# EAGLE design MCPTQFP100 (EAGLE 5.11)
PROJECT: Microchip TQFP-100 BB V1
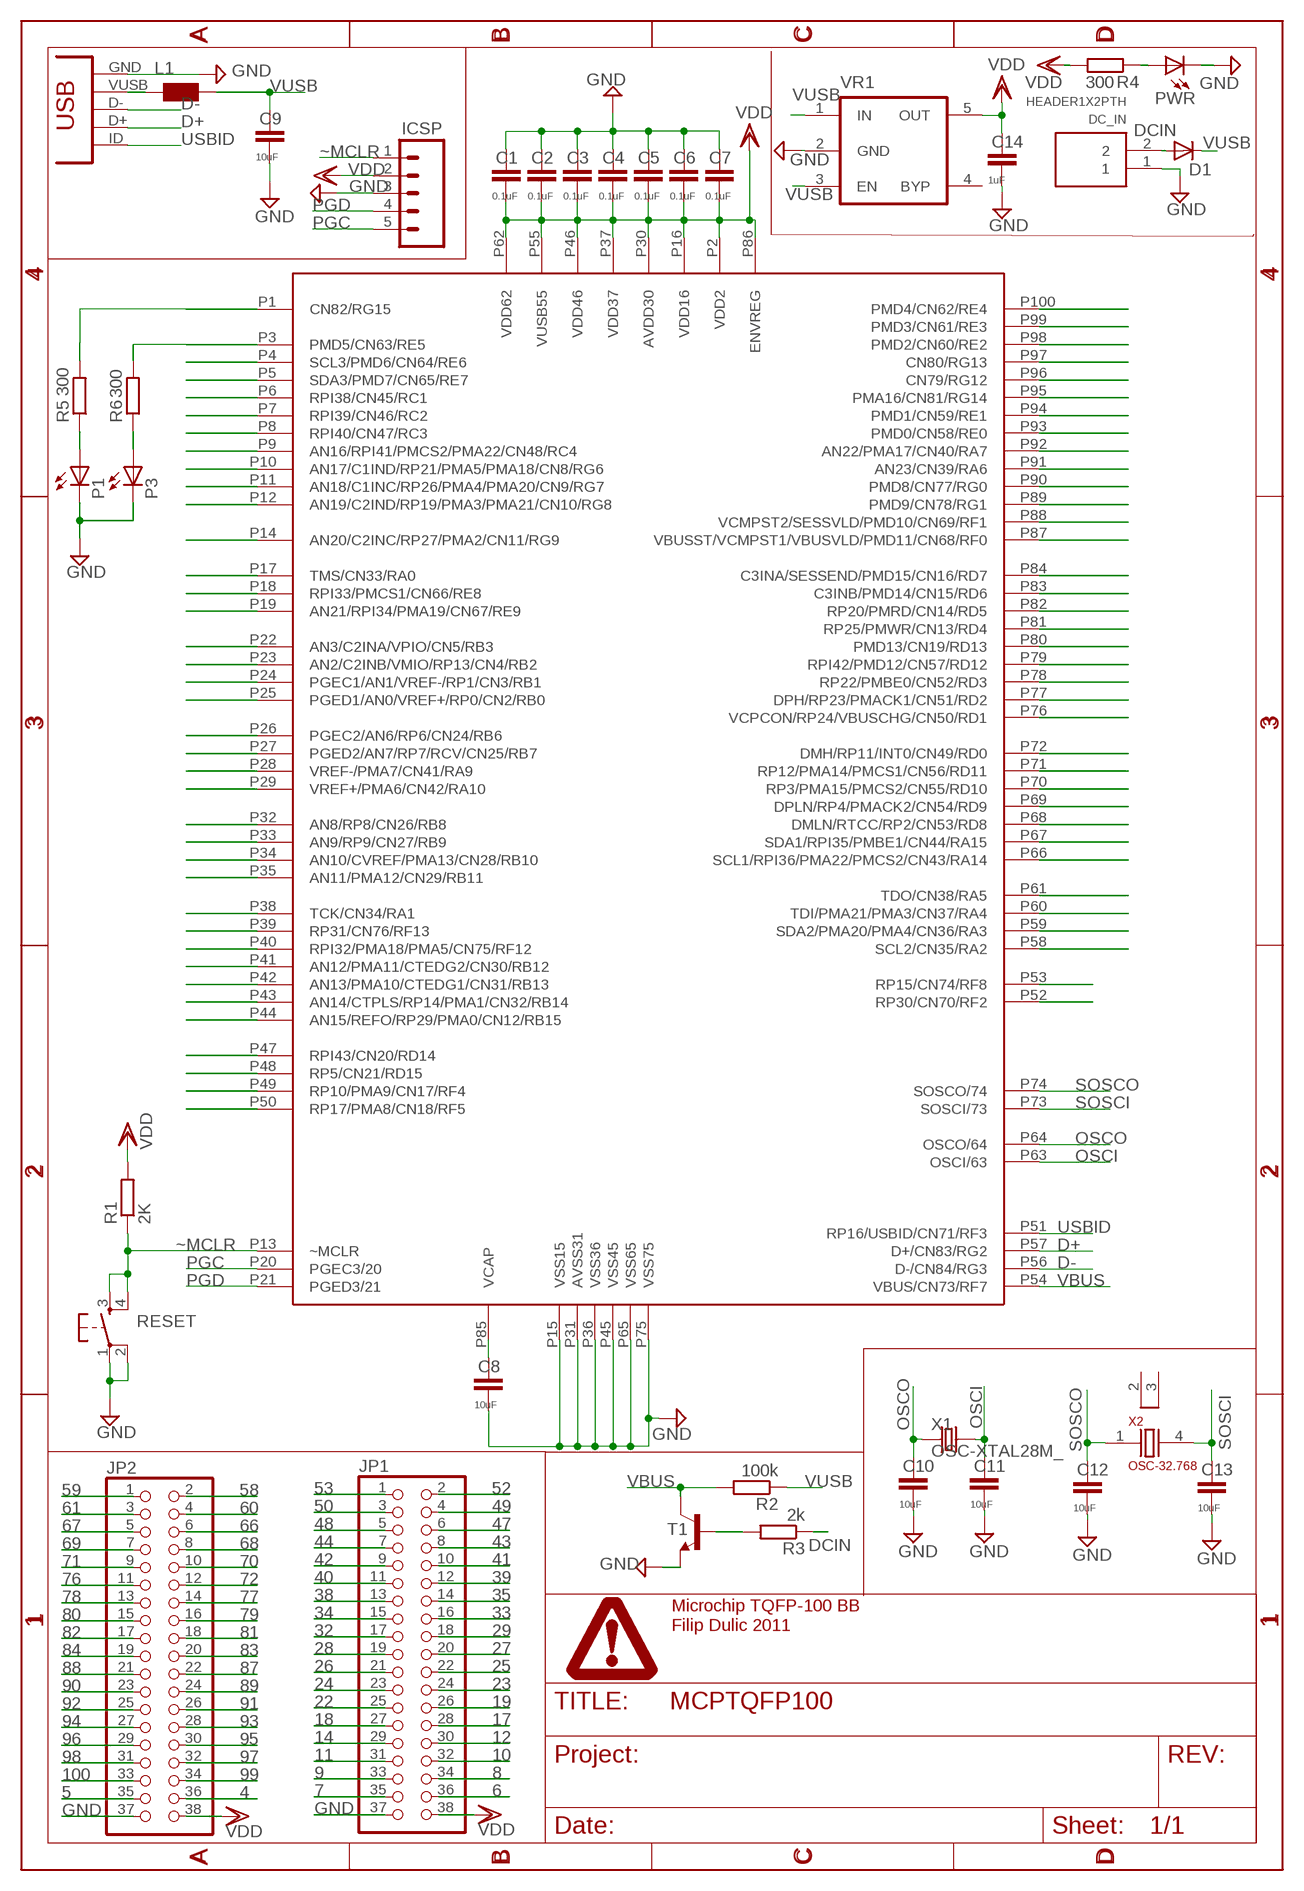
[diagram p0: schematic, sheet 1]

## Parts
C1  0.1uF  CAPC603  [C603]
C2  0.1uF  CAPC603  [C603]
C3  0.1uF  CAPC603  [C603]
C4  0.1uF  CAPC603  [C603]
C5  0.1uF  CAPC603  [C603]
C6  0.1uF  CAPC603  [C603]
C7  0.1uF  CAPC603  [C603]
C8  10uF  CAPC805  [C805]
C9  10uF  CAPC603  [C603]
C10  10uF  CAPC603  [C603]
C11  10uF  CAPC603  [C603]
C12  10uF  CAPC603  [C603]
C13  10uF  CAPC603  [C603]
C14  1uF  CAPC805  [C805]
D1  DIODE-SOD123  [SOD123]
DC_IN  HEADER1X2PTH  [M1X2]
IC1  PIC24FJ256GB210  [DP_DEVICES_TQFP100-12MMX12MM]
ICSP  M05PTH  [1X05]
JP1  PINHD-2X19  [2X19]
JP2  PINHD-2X19  [2X19]
L1  WE-KIL_0805  [WE-KI_0805_B]
P1  P4  LEDCHIP-LED0805  [CHIP-LED0805]
P3  P4  LEDCHIP-LED0805  [CHIP-LED0805]
PWR  P4  LEDCHIP-LED0805  [CHIP-LED0805]
R1  2K  RESISTORR805R805  [R805]
R2  100k  RESISTORR805R805  [R805]
R3  2k  RESISTORR805R805  [R805]
R4  300  RESISTORR805R805  [R805]
R5  300  RESISTORR805R805  [R805]
R6  300  RESISTORR805R805  [R805]
RESET  SW-SMD-SMALL  [TACT_SWITCH_SMALL]
T1  BJT-NPNSOT23EBC  [SOT23-EBC]
U$1  DINA4_L  [DP_LOGO]
USB  CON-USB-MINI-BUSB1  [CONN_USB_MINI-B]
VR1  MIC5205  [SOT-23-5]
X1  OSC-XTAL28M_  [5X8]
X2  OSC-32.768  [CM309S]

## Nets
1: IC1.P1(CN82/RG15) R5.2
3: IC1.P3(PMD5/CN63/RE5) R6.2
4: IC1.P4(SCL3/PMD6/CN64/RE6) JP2.36
5: IC1.P5(SDA3/PMD7/CN65/RE7) JP2.35
6: IC1.P6(RPI38/CN45/RC1) JP1.36
7: IC1.P7(RPI39/CN46/RC2) JP1.35
8: IC1.P8(RPI40/CN47/RC3) JP1.34
9: IC1.P9(AN16/RPI41/PMCS2/PMA22/CN48/RC4) JP1.33
10: IC1.P10(AN17/C1IND/RP21/PMA5/PMA18/CN8/RG6) JP1.32
11: IC1.P11(AN18/C1INC/RP26/PMA4/PMA20/CN9/RG7) JP1.31
12: IC1.P12(AN19/C2IND/RP19/PMA3/PMA21/CN10/RG8) JP1.30
14: IC1.P14(AN20/C2INC/RP27/PMA2/CN11/RG9) JP1.29
17: IC1.P17(TMS/CN33/RA0) JP1.28
18: IC1.P18(RPI33/PMCS1/CN66/RE8) JP1.27
19: IC1.P19(AN21/RPI34/PMA19/CN67/RE9) JP1.26
22: IC1.P22(AN3/C2INA/VPIO/CN5/RB3) JP1.25
23: IC1.P23(AN2/C2INB/VMIO/RP13/CN4/RB2) JP1.24
24: IC1.P24(PGEC1/AN1/VREF-/RP1/CN3/RB1) JP1.23
25: IC1.P25(PGED1/AN0/VREF+/RP0/CN2/RB0) JP1.22
26: IC1.P26(PGEC2/AN6/RP6/CN24/RB6) JP1.21
27: IC1.P27(PGED2/AN7/RP7/RCV/CN25/RB7) JP1.20
28: IC1.P28(VREF-/PMA7/CN41/RA9) JP1.19
29: IC1.P29(VREF+/PMA6/CN42/RA10) JP1.18
32: IC1.P32(AN8/RP8/CN26/RB8) JP1.17
33: IC1.P33(AN9/RP9/CN27/RB9) JP1.16
34: IC1.P34(AN10/CVREF/PMA13/CN28/RB10) JP1.15
35: IC1.P35(AN11/PMA12/CN29/RB11) JP1.14
38: IC1.P38(TCK/CN34/RA1) JP1.13
39: IC1.P39(RP31/CN76/RF13) JP1.12
40: IC1.P40(RPI32/PMA18/PMA5/CN75/RF12) JP1.11
41: IC1.P41(AN12/PMA11/CTEDG2/CN30/RB12) JP1.10
42: IC1.P42(AN13/PMA10/CTEDG1/CN31/RB13) JP1.9
43: IC1.P43(AN14/CTPLS/RP14/PMA1/CN32/RB14) JP1.8
44: IC1.P44(AN15/REFO/RP29/PMA0/CN12/RB15) JP1.7
47: IC1.P47(RPI43/CN20/RD14) JP1.6
48: IC1.P48(RP5/CN21/RD15) JP1.5
49: IC1.P49(RP10/PMA9/CN17/RF4) JP1.4
50: IC1.P50(RP17/PMA8/CN18/RF5) JP1.3
52: IC1.P52(RP30/CN70/RF2) JP1.2
53: IC1.P53(RP15/CN74/RF8) JP1.1
58: IC1.P58(SCL2/CN35/RA2) JP2.2
59: IC1.P59(SDA2/PMA20/PMA4/CN36/RA3) JP2.1
60: IC1.P60(TDI/PMA21/PMA3/CN37/RA4) JP2.4
61: IC1.P61(TDO/CN38/RA5) JP2.3
66: IC1.P66(SCL1/RPI36/PMA22/PMCS2/CN43/RA14) JP2.6
67: IC1.P67(SDA1/RPI35/PMBE1/CN44/RA15) JP2.5
68: IC1.P68(DMLN/RTCC/RP2/CN53/RD8) JP2.8
69: IC1.P69(DPLN/RP4/PMACK2/CN54/RD9) JP2.7
70: IC1.P70(RP3/PMA15/PMCS2/CN55/RD10) JP2.10
71: IC1.P71(RP12/PMA14/PMCS1/CN56/RD11) JP2.9
72: IC1.P72(DMH/RP11/INT0/CN49/RD0) JP2.12
76: IC1.P76(VCPCON/RP24/VBUSCHG/CN50/RD1) JP2.11
77: IC1.P77(DPH/RP23/PMACK1/CN51/RD2) JP2.14
78: IC1.P78(RP22/PMBE0/CN52/RD3) JP2.13
79: IC1.P79(RPI42/PMD12/CN57/RD12) JP2.16
80: IC1.P80(PMD13/CN19/RD13) JP2.15
81: IC1.P81(RP25/PMWR/CN13/RD4) JP2.18
82: IC1.P82(RP20/PMRD/CN14/RD5) JP2.17
83: IC1.P83(C3INB/PMD14/CN15/RD6) JP2.20
84: IC1.P84(C3INA/SESSEND/PMD15/CN16/RD7) JP2.19
87: IC1.P87(VBUSST/VCMPST1/VBUSVLD/PMD11/CN68/RF0) JP2.22
88: IC1.P88(VCMPST2/SESSVLD/PMD10/CN69/RF1) JP2.21
89: IC1.P89(PMD9/CN78/RG1) JP2.24
90: IC1.P90(PMD8/CN77/RG0) JP2.23
91: IC1.P91(AN23/CN39/RA6) JP2.26
92: IC1.P92(AN22/PMA17/CN40/RA7) JP2.25
93: IC1.P93(PMD0/CN58/RE0) JP2.28
94: IC1.P94(PMD1/CN59/RE1) JP2.27
95: IC1.P95(PMA16/CN81/RG14) JP2.30
96: IC1.P96(CN79/RG12) JP2.29
97: IC1.P97(CN80/RG13) JP2.32
98: IC1.P98(PMD2/CN60/RE2) JP2.31
99: IC1.P99(PMD3/CN61/RE3) JP2.34
100: IC1.P100(PMD4/CN62/RE4) JP2.33
D+: IC1.P57(D+/CN83/RG2) USB.D+
D-: IC1.P56(D-/CN84/RG3) USB.D-
DCIN: D1.A DC_IN.2 R3.1
GND: C1.1 C2.1 C3.1 C4.1 C5.1 C6.1 C7.1 C8.2 C9.2 C10.2 C11.2 C12.2 C13.2 C14.2 DC_IN.1 IC1.P15(VSS15) IC1.P31(AVSS31) IC1.P36(VSS36) IC1.P45(VSS45) IC1.P65(VSS65) IC1.P75(VSS75) ICSP.3 JP1.37 JP2.37 P1.C P3.C PWR.C RESET.1 RESET.2 T1.E USB.GND VR1.2(GND)
N$1: C8.1 IC1.P85(VCAP)
N$2: R3.2 T1.B
N$6: PWR.A R4.1
N$7: P1.A R5.1
N$8: P3.A R6.1
OSCI: C11.1 IC1.P63(OSCI/63) X1.2(X2)
OSCO: C10.1 IC1.P64(OSCO/64) X1.1(X1)
PGC: IC1.P20(PGEC3/20) ICSP.5
PGD: IC1.P21(PGED3/21) ICSP.4
SOSCI: C13.1 IC1.P73(SOSCI/73) X2.4
SOSCO: C12.1 IC1.P74(SOSCO/74) X2.1
USBID: IC1.P51(RP16/USBID/CN71/RF3) USB.ID(USBID)
VBUS: IC1.P54(VBUS/CN73/RF7) R2.2 T1.C
VDD: C1.2 C2.2 C3.2 C4.2 C5.2 C6.2 C7.2 C14.1 IC1.P2(VDD2) IC1.P16(VDD16) IC1.P30(AVDD30) IC1.P37(VDD37) IC1.P46(VDD46) IC1.P55(VUSB55) IC1.P62(VDD62) IC1.P86(ENVREG) ICSP.2 JP1.38 JP2.38 R1.2 R4.2 VR1.5(OUT)
VUSB: C9.1 D1.C L1.1 R2.1 VR1.1(IN) VR1.3(EN)
VUSBO: L1.2 USB.VUSB
~MCLR: IC1.P13(~MCLR) ICSP.1 R1.1 RESET.3 RESET.4
Unconnected: USB.BODY@1(BODY) USB.BODY@2(BODY) USB.BODY@3(BODY) USB.BODY@4(BODY) VR1.4(BYP) X2.2 X2.3

## Notes on the sheet
- Microchip TQFP-100 BB
- Filip Dulic 2011

## Library data of the parts
C1-C14 = dp_devices:CAP
D1 = diode:DIODE-: DIODE
DC_IN = dp_devices:HEADER1X2
IC1 = fica:PIC24FJ256GB210
ICSP = SparkFun:M05: Header 5 Standard 5-pin 0.1" header. Use with straight break away headers (SKU : PRT-00116), right angle break away headers (PRT-00553), swiss pins (PRT-00743), machine pins (PRT-00117), and female headers (PRT-00115). Molex polarized connector foot print use with SKU : PRT-08230 with associated crimp pins and housings.
JP1 JP2 = fica:PINHD-2X19: PIN HEADER
L1 = wuerth-elektronik:WE-KIL: SMD Wire Wound Ceramic Inductor WE-KIL - Low profile - High Q values -- Bluetooth -- Wireless LAN -- RF oscillation circuit -- IF impedance matching
P1 P3 PWR = led:LED: LED OSRAM: - CHIPLED LG R971, LG N971, LY N971, LG Q971, LY Q971, LO R971, LY R971 LH N974, LH R974 LS Q976, LO Q976, LY Q976 LO Q996 - Hyper CHIPLED LW Q18S LB Q993, LB Q99A, LB R99A - SideLED LS A670, LO A670, LY A670, LG A670, LP A670 LB A673, LV A673, LT A673, LW A673 LH A674 LY A675 LS A676, LA A676, LO A676, LY A676, LW A676 LS A679, LY A679, LG A679 - Hyper Micro SIDELED® LS Y876, LA Y876, LO Y876, LY Y876 LT Y87S - SmartLED LW L88C, LW L88S LB L89C, LB L89S, LG L890 LS L89K, LO L89K, LY L89K LS L896, LA L896, LO L896, LY L896 - TOPLED LS T670, LO T670, LY T670, LG T670, LP T670 LSG T670, LSP T670, LSY T670, LOP T670, LYG T670 LG T671, LOG T671, LSG T671 LB T673, LV T673, LT T673, LW T673 LH T674 LS T676, LA T676, LO T676, LY T676, LB T676, LH T676, LSB T676, LW T676 LB T67C, LV T67C, LT T67C, LS T67K, LO T67K, LY T67K, LW E67C LS E67B, LA E67B, LO E67B, LY E67B, LB E67C, LV E67C, LT E67C LW T67C LS T679, LY T679, LG T679 LS T770, LO T770, LY T770, LG T770, LP T770 LB T773, LV T773, LT T773, LW T773 LH T774 LS E675, LA E675, LY E675, LS T675 LS T776, LA T776, LO T776, LY T776, LB T776 LHGB T686 LT T68C, LB T68C - Hyper Mini TOPLED® LB M676 - Mini TOPLED Santana® LG M470 LS M47K, LO M47K, LY M47K Source: http://www.osram.convergy.de LUXEON: - LUMILED® LXK2-PW12-R00, LXK2-PW12-S00, LXK2-PW14-U00, LXK2-PW14-V00 LXK2-PM12-R00, LXK2-PM12-S00, LXK2-PM14-U00 LXK2-PE12-Q00, LXK2-PE12-R00, LXK2-PE12-S00, LXK2-PE14-T00, LXK2-PE14-U00 LXK2-PB12-K00, LXK2-PB12-L00, LXK2-PB12-M00, LXK2-PB14-N00, LXK2-PB14-P00, LXK2-PB14-Q00 LXK2-PR12-L00, LXK2-PR12-M00, LXK2-PR14-Q00, LXK2-PR14-R00 LXK2-PD12-Q00, LXK2-PD12-R00, LXK2-PD12-S00 LXK2-PH12-R00, LXK2-PH12-S00 LXK2-PL12-P00, LXK2-PL12-Q00, LXK2-PL12-R00 Source: www.luxeon.com KINGBRIGHT: KA-3528ASYC Source: www.kingbright.com
R1-R6 = dp_devices:RESISTOR
RESET = dp_devices:SW-SMD-SMALL
T1 = dp_devices:BJT-NPN: Most commonly used is SOT23-BEC
U$1 = dp_devices:DINA4_L: A4 DP frame Standard Dangerous Prototypes schematic frame. Automagically adds the DP logo and standard texts to the PCB Use the atrribute in the schematic editor to change the fields.; FF1: fulfillment by; FF2: Seeed Studio; FF3: www.seeedstudio.com; LICENSE: CC-BY-SA; PROJECT: Projectname; URL1: http://; URL2: DangerousPrototypes.com
USB = dp_devices:CON-USB-MINI-B: USB connector
VR1 = dp_devices:MIC5205: 150ma Low-Noise LDO Regulator
X1 = dp_devices:OSC-XTAL2
X2 = fica:OSC-32.768

## Board
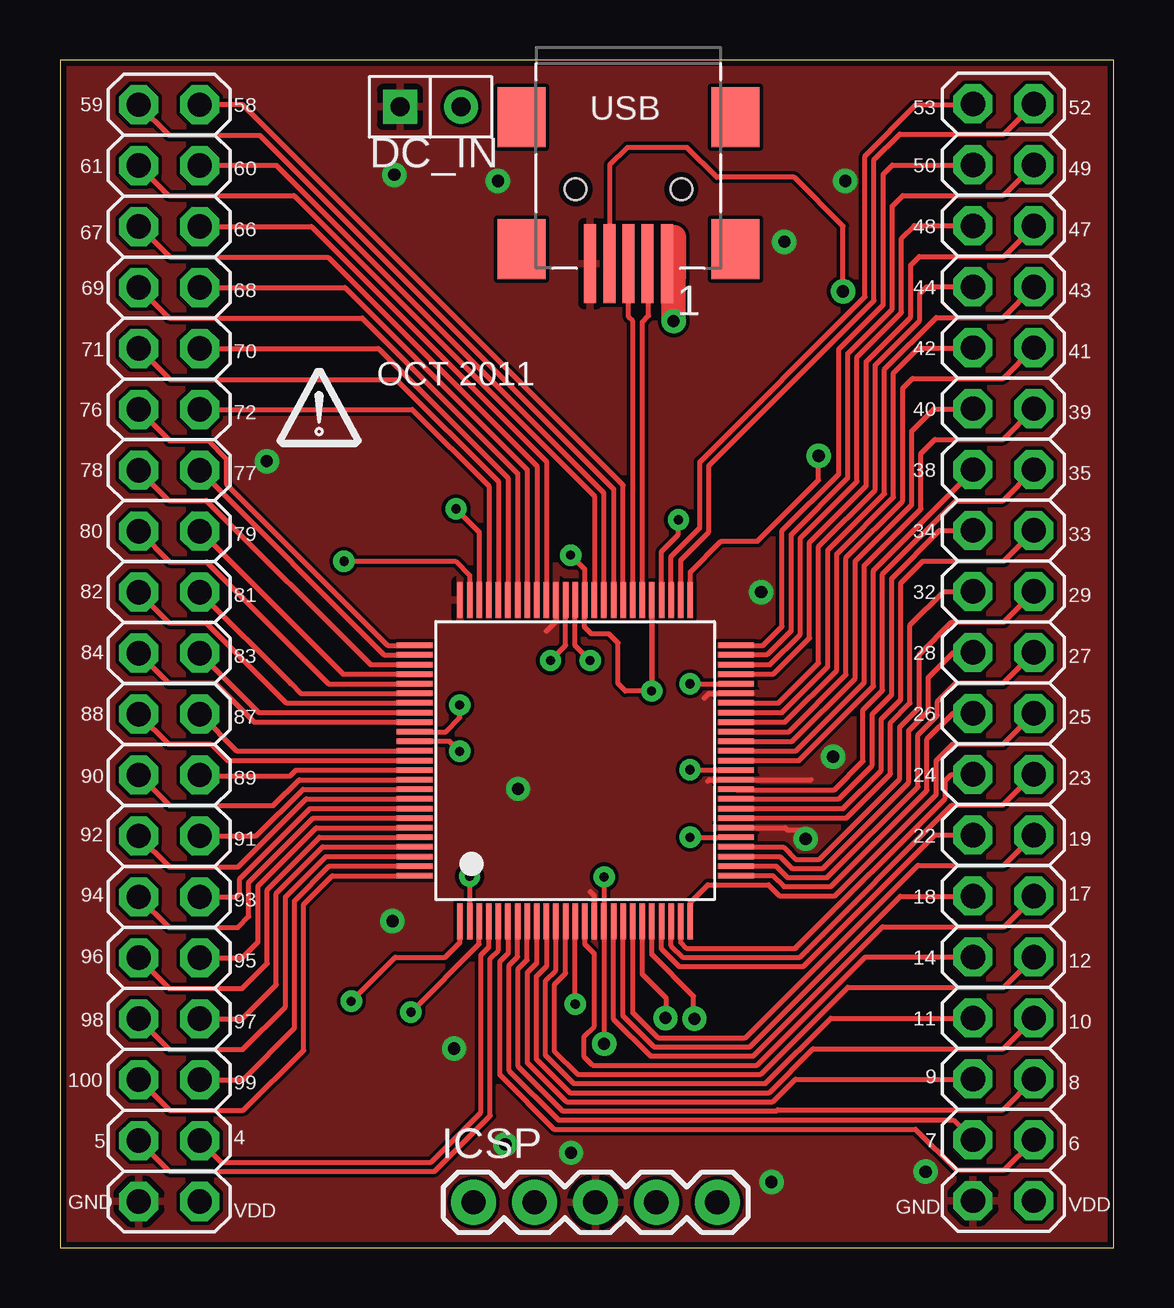
[diagram p1: board, top side]
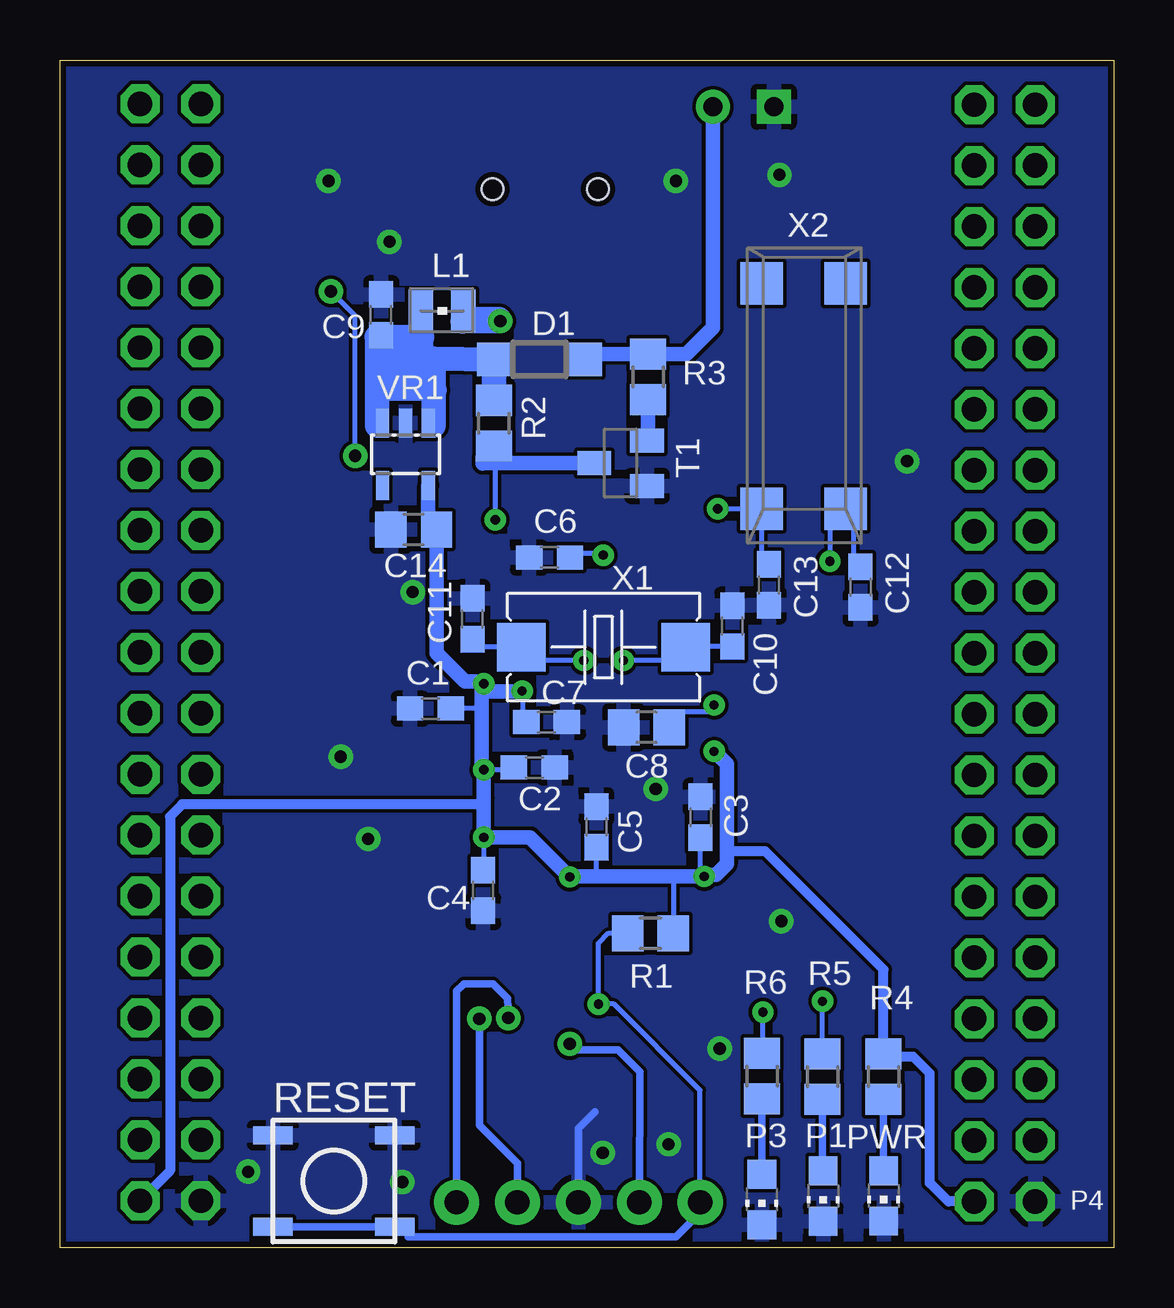
[diagram p2: board, bottom side, seen from below]

Size 43.93 x 49.52 mm. Coordinates in mm from the lower left corner, seen from the top.
Outline: 0,0 43.93,0 43.93,49.52 0,49.52 0,0
Copper layers (1*16): Top 0.035mm / dielectric 1.5mm / Bottom 0.035mm
Design rules "SparkFun *": minimum track width 8mil, minimum drill 15mil, track to track 6mil, track to pad 6mil, pad to pad 6mil, via to via 6mil, smd to smd 6mil, copper to edge 10mil, drill to drill 8mil, minimum pad ring 12mil, minimum via ring 10mil, stop-mask expansion 4mil, vias tented up to drill 25mil, thermal gap 10mil

### Footprints (pad centres in the part's own frame; a part is rotated, then mirrored left to right if it is on the bottom)
C603 = smd 1.1 x 1: 1 -0.85,0; 2 0.85,0
C805 = smd 1.3 x 1.5: 1 -0.95,0; 2 0.95,0
SOD123 = smd 1.4 x 1.4: A 1.9,0; C -1.9,0
M1X2 = drill 0.8 square: 1 -1.27,0 | drill 0.8 round: 2 1.27,0
DP_DEVICES_TQFP100-12MMX12MM = smd 0.23 x 1.5: P1 -4.8,-6.7; P2 -4.4,-6.7; P3 -4,-6.7; P4 -3.6,-6.7; P5 -3.2,-6.7; P6 -2.8,-6.7; P7 -2.4,-6.7; P8 -2,-6.7; P9 -1.6,-6.7; P10 -1.2,-6.7; P11 -0.8,-6.7; P12 -0.4,-6.7; P13 0,-6.7; P14 0.4,-6.7; P15 0.8,-6.7; P16 1.2,-6.7; P17 1.6,-6.7; P18 2,-6.7; P19 2.4,-6.7; P20 2.8,-6.7; P21 3.2,-6.7; P22 3.6,-6.7; P23 4,-6.7; P24 4.4,-6.7; P25 4.8,-6.7; P51 4.8,6.7; P52 4.4,6.7; P53 4,6.7; P54 3.6,6.7; P55 3.2,6.7; P56 2.8,6.7; P57 2.4,6.7; P58 2,6.7; P59 1.6,6.7; P60 1.2,6.7; P61 0.8,6.7; P62 0.4,6.7; P63 0,6.7; P64 -0.4,6.7; P65 -0.8,6.7; P66 -1.2,6.7; P67 -1.6,6.7; P68 -2,6.7; P69 -2.4,6.7; P70 -2.8,6.7; P71 -3.2,6.7; P72 -3.6,6.7; P73 -4,6.7; P74 -4.4,6.7; P75 -4.8,6.7 | smd 1.5 x 0.23: P26 6.7,-4.8; P27 6.7,-4.4; P28 6.7,-4; P29 6.7,-3.6; P30 6.7,-3.2; P31 6.7,-2.8; P32 6.7,-2.4; P33 6.7,-2; P34 6.7,-1.6; P35 6.7,-1.2; P36 6.7,-0.8; P37 6.7,-0.4; P38 6.7,0; P39 6.7,0.4; P40 6.7,0.8; P41 6.7,1.2; P42 6.7,1.6; P43 6.7,2; P44 6.7,2.4; P45 6.7,2.8; P46 6.7,3.2; P47 6.7,3.6; P48 6.7,4; P49 6.7,4.4; P50 6.7,4.8; P76 -6.7,4.8; P77 -6.7,4.4; P78 -6.7,4; P79 -6.7,3.6; P80 -6.7,3.2; P81 -6.7,2.8; P82 -6.7,2.4; P83 -6.7,2; P84 -6.7,1.6; P85 -6.7,1.2; P86 -6.7,0.8; P87 -6.7,0.4; P88 -6.7,0; P89 -6.7,-0.4; P90 -6.7,-0.8; P91 -6.7,-1.2; P92 -6.7,-1.6; P93 -6.7,-2; P94 -6.7,-2.4; P95 -6.7,-2.8; P96 -6.7,-3.2; P97 -6.7,-3.6; P98 -6.7,-4; P99 -6.7,-4.4; P100 -6.7,-4.8
1X05 = drill 1.016 pad 1.88 round: 1 0,0; 2 2.54,0; 3 5.08,0; 4 7.62,0; 5 10.16,0
2X19 = drill 1.016 octagon: 1 -22.86,-1.27; 2 -22.86,1.27; 3 -20.32,-1.27; 4 -20.32,1.27; 5 -17.78,-1.27; 6 -17.78,1.27; 7 -15.24,-1.27; 8 -15.24,1.27; 9 -12.7,-1.27; 10 -12.7,1.27; 11 -10.16,-1.27; 12 -10.16,1.27; 13 -7.62,-1.27; 14 -7.62,1.27; 15 -5.08,-1.27; 16 -5.08,1.27; 17 -2.54,-1.27; 18 -2.54,1.27; 19 0,-1.27; 20 0,1.27; 21 2.54,-1.27; 22 2.54,1.27; 23 5.08,-1.27; 24 5.08,1.27; 25 7.62,-1.27; 26 7.62,1.27; 27 10.16,-1.27; 28 10.16,1.27; 29 12.7,-1.27; 30 12.7,1.27; 31 15.24,-1.27; 32 15.24,1.27; 33 17.78,-1.27; 34 17.78,1.27; 35 20.32,-1.27; 36 20.32,1.27; 37 22.86,-1.27; 38 22.86,1.27
WE-KI_0805_B = smd 1.02 x 1.78: 1 -0.89,0; 2 0.89,0
CHIP-LED0805 = smd 1.2 x 1.2: A 0,-1.05; C 0,1.05
R805 = smd 1.3 x 1.5: 1 -0.95,0; 2 0.95,0
TACT_SWITCH_SMALL = smd 1.651 x 0.762: 1 -2.54,1.905; 2 2.54,1.905; 3 -2.54,-1.905; 4 2.54,-1.905
SOT23-EBC = smd 1 x 1.4: B 0.95,-1.1; C 0,1.1; E -0.95,-1.1
CONN_USB_MINI-B = smd 2 x 2.5: BODY@1 -4.45,2.5; BODY@2 4.45,2.5; BODY@3 4.45,-3; BODY@4 -4.45,-3 | smd 0.5 x 3.3: D+ 0,3.1; D- -0.8,3.1; GND 1.6,3.1; ID 0.8,3.1; VUSB -1.6,3.1 | hole 0.9: -2.2,0; 2.2,0
SOT-23-5 = smd 0.55 x 1.2: 1 -0.95,-1.3; 2 0,-1.3; 3 0.95,-1.3; 4 0.95,1.3; 5 -0.95,1.3
5X8 = smd 2.032 x 2.032: 1 -3.429,0; 2 3.429,0
CM309S = smd 1.778 x 1.778: 1 -4.7,-1.75; 2 4.7,-1.75; 3 4.7,1.75; 4 -4.7,1.75

### Placement (x,y rotation side)
C1  28.49,22.48 0 bottom
C2  24.16,20.03 180 bottom
C3  17.23,17.96 270 bottom
C4  26.29,14.9 90 bottom
C5  21.57,17.55 270 bottom
C6  23.52,28.78 0 bottom
C7  23.65,21.92 180 bottom
C8  19.48,21.7 180 bottom
C9  30.54,38.89 90 bottom
C10  15.91,25.92 90 bottom
C11  26.73,26.23 90 bottom
C12  10.56,27.55 270 bottom
C13  14.38,27.64 270 bottom
C14  29.18,29.94 180 bottom
D1  23.94,37.04 0 bottom
DC_IN  15.44,47.57 0 top
IC1  21.48,20.32 0 top
ICSP  17.24,1.91 0 top
JP1  39.33,24.83 270 top
JP2  4.55,24.8 270 top
L1  28,39.06 0 bottom
P1  12.12,2.17 180 bottom
P3  14.67,2.02 180 bottom
PWR  9.6,2.17 180 bottom
R1  19.32,13.12 0 bottom
R2  25.84,34.38 270 bottom
R3  19.42,36.32 270 bottom
R4  9.6,7.14 90 bottom
R5  12.14,7.14 90 bottom
R6  14.67,7.16 90 bottom
RESET  32.51,2.79 0 bottom
T1  20.56,32.72 90 bottom
U$1  10.79,34.04 0 top
USB  23.7,44.13 180 top
VR1  29.53,33.08 180 bottom
X1  21.27,25.04 180 bottom
X2  12.93,35.51 90 bottom

### Tracks (layer width: path | path; a pad name or v marks a point on that pad's centre or on a via)
1  (via drill 0.38)
  Top 0.203: IC1.P1 16.68,12.74 16.05,12.12 13.97,12.12 v12.14,10.29
  Bottom 0.203: R5.2 v12.14,10.29
3  (via drill 0.38)
  Top 0.203: IC1.P3 17.48,12.68 v14.63,9.83
  Bottom 0.203: v14.63,9.83 14.63,8.15 R6.2
4
  Top 0.203: IC1.P4 17.88,12.54 17.55,12.22 17.55,5.66 15.47,3.58 6.72,3.58 JP2.36
5
  Top 0.203: IC1.P5 18.28,12.41 17.93,12.07 17.93,5.51 15.62,3.2 4.55,3.2 JP2.35
6
  Top 0.203: JP1.36 40.6,4.48 39.37,3.25 37.36,3.25 35.66,4.95 20.6,4.95 18.34,7.21 18.34,11.94 18.69,12.29 18.69,13.6 IC1.P6
7
  Top 0.203: IC1.P7 19.08,12.14 18.72,11.79 18.72,7.39 20.78,5.33 37.23,5.33 JP1.35
8
  Top 0.203: JP1.34 39.32,5.77 29.92,5.77 29.87,5.72 20.96,5.72 19.1,7.57 19.1,11.63 19.48,12.01 IC1.P8
9
  Top 0.203: IC1.P9 19.88,11.87 19.48,11.48 19.48,7.72 21.11,6.1 29.72,6.1 30.66,7.04 38.04,7.04 JP1.33
10
  Top 0.203: JP1.32 39.32,8.31 31.39,8.31 29.57,6.48 21.26,6.48 19.86,7.87 19.86,11.33 20.29,11.76 20.29,13.6 IC1.P10
11
  Top 0.203: IC1.P11 20.68,11.58 20.24,11.15 20.24,8.03 21.41,6.86 29.41,6.86 32.13,9.58 38.04,9.58 JP1.31
12
  Top 0.203: IC1.P12 21.08,11.45 20.63,11 20.63,8.18 21.56,7.24 29.21,7.24 32.84,10.87 39.34,10.87 JP1.30
14
  Top 0.203: JP1.29 33.57,12.13 29.06,7.62 22.2,7.62 21.84,7.98 21.84,8.81 22.28,9.25 22.28,12.27 21.9,12.65 21.9,13.6 IC1.P14
17
  Top 0.203: IC1.P17 23.08,9.54 24.61,8 28.91,8 34.29,13.39 39.37,13.39 40.6,14.61 JP1.28
18
  Top 0.203: IC1.P18 23.48,9.67 24.77,8.38 28.75,8.38 35.03,14.66 38.04,14.66 JP1.27
19
  Top 0.203: IC1.P19 23.88,9.8 24.92,8.76 28.58,8.76 35.76,15.95 39.34,15.95 JP1.26
22
  Top 0.203: JP1.25 36.46,17.21 30.99,11.73 25.81,11.73 25.07,12.47 IC1.P22
23
  Top 0.203: JP1.24 40.58,19.75 39.29,18.47 37.19,18.47 30.84,12.12 25.96,12.12 25.48,12.6 IC1.P23
24
  Top 0.203: IC1.P24 25.88,12.73 26.11,12.5 30.68,12.5 30.68,12.52 36.91,18.75 36.91,19.48 37.16,19.74 38.04,19.74 JP1.23
25
  Top 0.203: IC1.P25 26.28,14.41 27,15.14 29.54,15.14 30,14.68 32.31,14.68 36.53,18.9 36.53,20.32 37.21,21.01 39.32,21.01 JP1.22
26
  Top 0.203: IC1.P26 29.72,15.52 30.18,15.06 32.13,15.06 36.14,19.08 36.14,21.21 37.24,22.3 38.04,22.3 JP1.21
27
  Top 0.203: JP1.20 39.32,23.55 37.34,23.55 36.58,22.78 36.58,22.2 35.76,21.39 35.76,19.23 31.98,15.44 30.33,15.44 29.85,15.92 IC1.P27
28
  Top 0.203: IC1.P28 30.01,16.32 30.51,15.82 31.8,15.82 35.38,19.41 35.38,21.56 36.2,22.38 36.2,23.77 37.26,24.84 38.04,24.84 JP1.19
29
  Top 0.203: JP1.18 40.6,27.34 39.34,26.09 37.16,26.09 35.81,24.74 35.81,22.53 35,21.72 35,19.56 31.65,16.21 30.66,16.21 30.15,16.71 IC1.P29
32
  Top 0.203: IC1.P32 32.78,17.92 34.62,19.76 34.62,21.89 35.43,22.71 35.43,25.96 36.84,27.37 JP1.17
33
  Top 0.203: JP1.16 40.6,29.88 39.34,28.63 35.97,28.63 35.05,27.71 35.05,22.86 34.24,22.05 34.24,19.91 32.64,18.31 IC1.P33
34
  Top 0.203: JP1.15 36.67,29.91 34.67,27.91 34.67,23.06 33.86,22.25 33.86,20.12 32.46,18.72 IC1.P34
  Top 0.305: JP1.15 38.02,29.94
35
  Top 0.203: JP1.14 39.29,31.14 37.34,31.14 34.29,28.09 34.29,23.24 33.48,22.43 33.48,20.29 32.28,19.1 28.2,19.1 IC1.P35
38
  Top 0.203: IC1.P38 30.81,20.32 33.91,23.42 33.91,28.24 38.13,32.46 38.04,32.46 JP1.13
39
  Top 0.203: JP1.12 39.32,33.71 36.47,33.71 35.89,33.12 35.89,30.81 33.53,28.45 33.53,23.57 30.68,20.73 28.18,20.73 IC1.P39
40
  Top 0.203: IC1.P40 30.52,21.12 33.15,23.75 33.15,28.63 35.51,30.99 35.51,34.06 36.42,34.98 38.04,34.98 JP1.11
41
  Top 0.203: JP1.10 39.32,36.25 35.53,36.25 35.13,35.84 35.13,31.14 32.77,28.78 32.77,23.9 30.38,21.51 IC1.P41
42
  Top 0.203: IC1.P42 30.23,21.92 32.39,24.08 32.39,28.93 34.75,31.29 34.75,36.47 35.79,37.52 38.04,37.52 JP1.9
43
  Top 0.203: IC1.P43 30.09,22.32 32,24.23 32,29.08 34.37,31.45 34.37,36.63 36.53,38.79 39.32,38.79 JP1.8
44
  Top 0.203: JP1.7 36.13,40.07 35.84,39.78 35.84,38.66 33.99,36.8 33.99,31.6 31.62,29.24 31.62,24.38 29.95,22.71 IC1.P44
47
  Top 0.203: JP1.6 40.6,42.58 39.34,41.33 35.81,41.33 35.46,40.97 35.46,38.81 33.6,36.96 33.6,31.78 31.24,29.41 31.24,25.43 29.74,23.93 IC1.P47
48
  Top 0.203: IC1.P48 29.6,24.32 30.86,25.58 30.86,29.59 33.22,31.95 33.22,37.13 35.08,38.99 35.08,42.09 35.61,42.62 38.04,42.62 JP1.5
49
  Top 0.203: JP1.4 39.32,43.87 35.13,43.87 34.7,43.43 34.7,39.14 32.84,37.29 32.84,32.11 30.48,29.74 30.48,25.73 29.49,24.74 28.2,24.74 IC1.P49
50
  Top 0.203: IC1.P50 29.31,25.12 30.1,25.91 30.1,29.9 32.46,32.26 32.46,37.47 34.32,39.32 34.32,44.75 34.7,45.14 38.04,45.14 JP1.3
52
  Top 0.203: JP1.2 39.34,46.43 35,46.43 33.93,45.36 33.93,39.5 27.05,32.61 27.05,29.85 25.88,28.68 25.88,27.03 IC1.P52
53
  Top 0.203: IC1.P53 25.48,28.83 26.67,30.02 26.67,32.77 33.55,39.65 33.55,45.52 35.69,47.65 38.02,47.65 JP1.1
58
  Top 0.203: JP2.2 7.61,47.66 23.48,31.79 IC1.P58
59
  Top 0.203: JP2.1 3.28,47.64 4.55,46.38 8.33,46.38 23.08,31.64 IC1.P59
60
  Top 0.203: JP2.4 9.04,45.12 22.68,31.48 IC1.P60
61
  Top 0.203: JP2.3 4.52,43.87 9.75,43.87 22.28,31.34 IC1.P61
66
  Top 0.203: JP2.6 10.48,42.58 20.28,32.79 IC1.P66
67
  Top 0.203: IC1.P67 19.88,32.6 11.18,41.3 4.6,41.3 3.32,42.58 JP2.5
68
  Top 0.203: JP2.8 11.88,40.04 19.48,32.44 IC1.P68
69
  Top 0.203: JP2.7 4.55,38.76 12.6,38.76 19.08,32.28 IC1.P69
70
  Top 0.203: IC1.P70 18.68,32.1 13.28,37.5 JP2.10
71
  Top 0.203: JP2.9 3.3,37.5 4.6,36.2 14.02,36.2 18.28,31.94 IC1.P71
72
  Top 0.203: IC1.P72 17.88,31.76 14.68,34.95 JP2.12
76
  Top 0.203: JP2.11 3.28,34.94 4.57,33.66 6.17,33.66 6.93,32.89 6.93,31.85 13.67,25.12 IC1.P76
77
  Top 0.203: IC1.P77 13.52,24.72 JP2.14
78
  Top 0.203: JP2.13 3.28,32.4 4.52,31.17 6.1,31.17 12.94,24.32 IC1.P78
79
  Top 0.203: JP2.16 5.84,29.88 11.79,23.92 IC1.P79
80
  Top 0.203: JP2.15 3.3,29.88 4.57,28.6 6.12,28.6 11.2,23.52 IC1.P80
81
  Top 0.203: JP2.18 5.82,27.32 9.63,23.52 | 9.63,23.52 9.6,23.52 | IC1.P81 10.03,23.12 9.63,23.52
82
  Top 0.203: JP2.17 3.28,27.32 4.55,26.06 6.1,26.06 9.44,22.72 IC1.P82
83
  Top 0.203: JP2.20 8.29,22.32 IC1.P83
84
  Top 0.203: IC1.P84 8.1,21.92 6.48,23.55 4.53,23.55 JP2.19
87
  Top 0.203: JP2.22 5.84,22.26 7.37,20.72 IC1.P87
88
  Top 0.203: JP2.21 4.52,21.01 6.3,21.01 6.99,20.32 IC1.P88
89
  Top 0.203: IC1.P89 9.84,19.92 9.6,19.69 5.86,19.69 JP2.24
90
  Top 0.203: JP2.23 3.3,19.72 4.57,18.44 8.89,18.44 9.97,19.52 IC1.P90
91
  Top 0.203: IC1.P91 10.13,19.12 8.19,17.18 JP2.26
92
  Top 0.203: JP2.25 3.28,17.16 4.57,15.88 7.42,15.88 10.26,18.72 IC1.P92
93
  Top 0.203: JP2.28 7.35,14.64 7.49,14.78 7.49,15.39 10.42,18.32 IC1.P93
94
  Top 0.203: JP2.27 4.55,13.36 7.42,13.36 7.87,13.82 7.87,15.24 10.55,17.92 IC1.P94
95
  Top 0.203: IC1.P95 10.69,17.52 8.26,15.09 8.26,12.75 7.59,12.09 JP2.30
96
  Top 0.203: IC1.P96 10.82,17.12 8.64,14.94 8.64,11.86 7.59,10.82 4.55,10.82 3.28,12.08 JP2.29
97
  Top 0.203: IC1.P97 10.95,16.72 9.02,14.78 9.02,10.97 7.6,9.56 JP2.32
98
  Top 0.203: IC1.P98 11.09,16.32 9.4,14.63 9.4,10.06 7.62,8.28 4.55,8.28 JP2.31
99
  Top 0.203: IC1.P99 11.22,15.92 9.78,14.48 9.78,9.17 7.63,7.02 JP2.34
100
  Top 0.203: JP2.33 3.3,7.02 4.57,5.74 7.65,5.74 10.16,8.23 10.16,14.33 11.35,15.52 IC1.P100
D+
  Top 0.203: IC1.P57 23.88,38.63 23.7,38.81 USB.D+
D-
  Top 0.203: IC1.P56 24.28,38.6 24.54,38.86 24.54,41.02
  Top 0.254: 24.54,41.02 USB.D-
DCIN
  Bottom 0.61: DC_IN.2 16.71,38.35 17.81,37.26 R3.1 | R3.1 | R3.1 21.82,37.26 D1.A
GND  (via drill 0.51)
  Top 0.203: IC1.P31 30.23,17.52 30.33,17.42 30.84,17.42 31.16,17.1 | 31.32,19.52 IC1.P36 27.06,19.52 27,19.46 | IC1.P45 27.06,23.12 26.85,22.91 | IC1.P15 22.28,14.68 22.1,14.86 | IC1.P65 20.68,26.11 20.27,25.7 | 37.8,1.71 JP1.37
  Bottom 0.305: 21.62,5.68 22.32,4.98 ICSP.3
  other vias: 30.19,41.94 32.73,44.48 8.62,32.8 13.94,44.74 18.26,44.48 19.09,19.13 29.23,27.34 32.23,20.48 31.08,17.05 29.66,2.75 36.09,3.18 21.3,3.97 18.56,4.32 16.43,8.31 13.86,13.62
  pour Top: -0.13,49.53 43.94,49.53 43.94,0 -0.13,0
  pour Bottom: 43.94,49.53 43.94,0 -0.13,0 -0.13,49.53
N$1  (via drill 0.38)
  Top 0.203: IC1.P85 16.08,21.52 16.66,22.1 v16.66,22.63
  Bottom 0.203: 16.66,22.58 v16.66,22.63 16.94,22.35 18.11,22.35 18.28,21.8 C8.1
N$2
  Bottom 0.61: R3.2 19.42,33.71 T1.B
N$6
  Bottom 0.305: PWR.A 9.6,3.44 R4.1
N$7
  Bottom 0.305: R5.1 12.14,3.31 P1.A
N$8
  Bottom 0.305: P3.A 14.67,4.51 R6.1
OSCI  (via drill 0.38)
  Top 0.203: IC1.P63 21.48,25.11 v22.1,24.49
  Bottom 0.203: v22.1,24.49 24.14,24.49 X1.2 26.48,25.04 C11.1
OSCO  (via drill 0.38)
  Top 0.203: IC1.P64 21.08,25.11 v20.45,24.49
  Bottom 0.203: v20.45,24.49 18.4,24.49 X1.1 17.82,25.07 C10.1
PGC  (via drill 0.51)
  Top 0.203: IC1.P20 24.28,11.41 25.27,10.41 25.27,9.62 v25.24,9.59
  Bottom 0.305: v25.24,9.59 25.27,10.41 25.88,11.02 27.1,11.02 27.4,10.71 | ICSP.5 27.4,10.71 | 27.4,10.71 27.41,10.72
PGD  (via drill 0.51)
  Top 0.203: IC1.P21 24.68,12.23 26.42,10.49 26.42,9.59 v26.45,9.56
  Bottom 0.305: ICSP.4 24.86,3.02 24.86,3.52 26.45,5.11 v26.45,9.56
SOSCI  (via drill 0.38)
  Top 0.203: IC1.P73 17.48,29.84 v16.51,30.81
  Bottom 0.203: v16.51,30.81 X2.4 14.68,28.55 C13.1
SOSCO  (via drill 0.38)
  Top 0.203: IC1.P74 17.08,28.03 16.48,28.63 v11.84,28.63
  Bottom 0.203: v11.84,28.63 11.84,30.15 X2.1 10.85,30.48 10.85,28.63 10.64,28.42 C12.1
USBID  (via drill 0.51 pad 1.02)
  Top 0.203: IC1.P51 26.28,28.18 27.56,29.46 29.08,29.46 31.62,32 v31.62,33.02 | v32.64,39.88 32.64,42.6 30.61,44.63 27.38,44.63 26.14,45.87 23.65,45.87 22.91,45.14 22.91,41.83 23.04,41.71 23.04,41.17 USB.ID
  Bottom 0.203: v31.62,33.02 31.62,38.86 v32.64,39.88
VBUS  (via drill 0.38)
  Top 0.203: IC1.P54 25.08,29.04 25.78,29.74 v25.78,30.35
  Bottom 0.203: v25.78,30.35 25.78,32.43 26.31,32.96
  Bottom 0.61: T1.C 26.29,32.72 26.31,32.69 26.31,32.96 R2.2
VDD  (via drill 0.38, 0.51)
  Top 0.203: IC1.P46 26.7,23.52 v26.26,23.52 | IC1.P37 26.28,19.92 v26.26,19.94 | IC1.P30 v26.26,17.12 | v22.68,15.47 v22.68,15.46 IC1.P16 v22.68,8.52 v22.68,8.51 | IC1.P86 16.24,21.12 v16.66,20.7 | IC1.P2 v17.08,15.49 v17.07,15.49 | v21.29,28.88 21.88,28.29 IC1.P62 21.87,25.88 22.15,25.6 22.89,25.6 23.27,25.22 23.27,23.52 23.57,23.22 24.64,23.22 24.68,23.25 IC1.P55 24.68,23.23 v24.66,23.22
  Bottom 0.203: v26.26,23.52 26.67,23.52 | 26.26,19.91 v26.26,19.94 25.1,19.94 C2.2 | 26.21,17.12 v26.26,17.12 26.26,15.78 C4.2 | 22.66,15.49 v22.68,15.47 | v16.66,20.7 16.64,20.68 | 17.04,15.54 17.08,15.51 v17.08,15.49 17.23,15.64 C3.2 | v21.29,28.88 21.29,28.96 22.49,28.96 C6.2 | v24.66,23.22 24.66,23.19 24.64,23.16 24.64,22.06 C7.2 | C5.2 21.57,15.64 21.72,15.49 | C1.2 26.49,22.48 26.37,22.35 | R1.2 18.37,15.45 18.42,15.49
  Bottom 0.305: ICSP.2 19.75,7.33 20.67,8.26 22.43,8.26 v22.68,8.51
  Bottom 0.406: JP1.38 39.34,3.23 39.34,17.98 38.84,18.49 26.52,18.49 26.26,18.75 | JP2.38 6.89,1.94 7.67,2.72 7.67,7.29 8.36,7.98 9.48,7.98 R4.2 9.6,11.61 14.53,16.54 16.13,16.54
  Bottom 0.61: VR1.5 28.58,30.42 C14.1 28.23,24.81 27.05,23.62 26.37,23.62 | 26.37,23.62 v26.26,23.52 | 26.37,22.99 26.37,22.35 26.37,20.04 v26.26,19.94 26.26,18.75 v26.26,17.12 | 26.37,22.99 26.37,23.62 | v26.26,17.12 24.33,17.12 v22.68,15.47 | 22.66,15.49 21.72,15.49 18.42,15.49 v17.08,15.49 | 17.04,15.54 16.59,15.54 16.13,16 16.13,16.54 16.13,20.17 v16.66,20.7 | 24.66,23.19 26.16,23.19 26.37,22.99
VUSB
  Bottom 0.203: R2.1
  Bottom 0.254: VR1.3 30.48,33.91 30.7,34.29 | 28.35,34.29 28.48,34.29 VR1.1
  Bottom 0.305: 30.61,37.97 C9.1
  Bottom 1.016: 30.7,35.81 30.7,34.29 | 28.38,35.81 28.83,35.81 | 28.83,35.81 30.7,35.81 | 28.38,35.81 28.32,35.75 | 28.35,35.81 28.38,35.81 | 28.35,35.81 28.35,34.29 | 30.7,35.81 30.7,37.88 30.61,37.97 | 28.35,35.81 28.35,37.07 D1.C R2.1 | L1.1 28.86,35.85 28.83,35.81 | 30.61,37.97 28.83,37.97 | 30.61,37.97 30.73,37.97 | 30.61,37.97 30.61,37.08 28.96,37.08 28.96,36.58 30.35,36.58
VUSBO  (via drill 0.51)
  Top 0.254: 25.6,42.14 25.6,41.29 USB.VUSB
  Top 1.016: v25.58,38.63 25.6,42.14
  Bottom 0.305: L1.2 27.18,38.84 27.15,38.61
  Bottom 1.016: 27.15,38.61 v25.58,38.63 25.63,38.71 26.98,38.71 27.15,38.61
~MCLR  (via drill 0.38)
  Top 0.203: IC1.P13 v21.48,10.17 v21.49,10.16
  Bottom 0.203: v21.49,10.16 21.49,12.7 21.06,13.13 20.28,13.13 R1.1 | v21.48,10.17 20.84,10.17 17.25,6.58 ICSP.1
  Bottom 0.305: 17.21,1.46 ICSP.1 17.24,1.49 18.26,0.48 29.43,0.48 29.43,0.85 29.46,0.89 RESET.4 RESET.3

### Text on the board
tPlace: 58 | 53 | 52 | 60 | 50 | 49 | 66 | 48 | 47 | 68 | 44 | 43 | 70 | 42 | 41 | 72 | 40 | 39 | 77 | 38 | 35 | 34 | 79 | 33 | 81 | 32 | 29 | 83 | 28 | 27 | 87 | 26 | 25 | 89 | 24 | 23 | 91 | 22 | 19 | 93 | 18 | 17 | 95 | 14 | 12 | 97 | 11 | 10 | 99 | 9 | 8 | 4 | 7 | 7 | 6 | GND | VDD | VDD
tNames: 59 | 61 | 67 | 69 | 71 | OCT 2011 | 76 | 78 | 80 | 82 | 84 | 88 | 90 | 92 | 94 | 96 | 98 | 100 | 5 | GND
bNames: P4